# EAGLE design CAN_node_rpm_f2v (EAGLE 8.0.1)
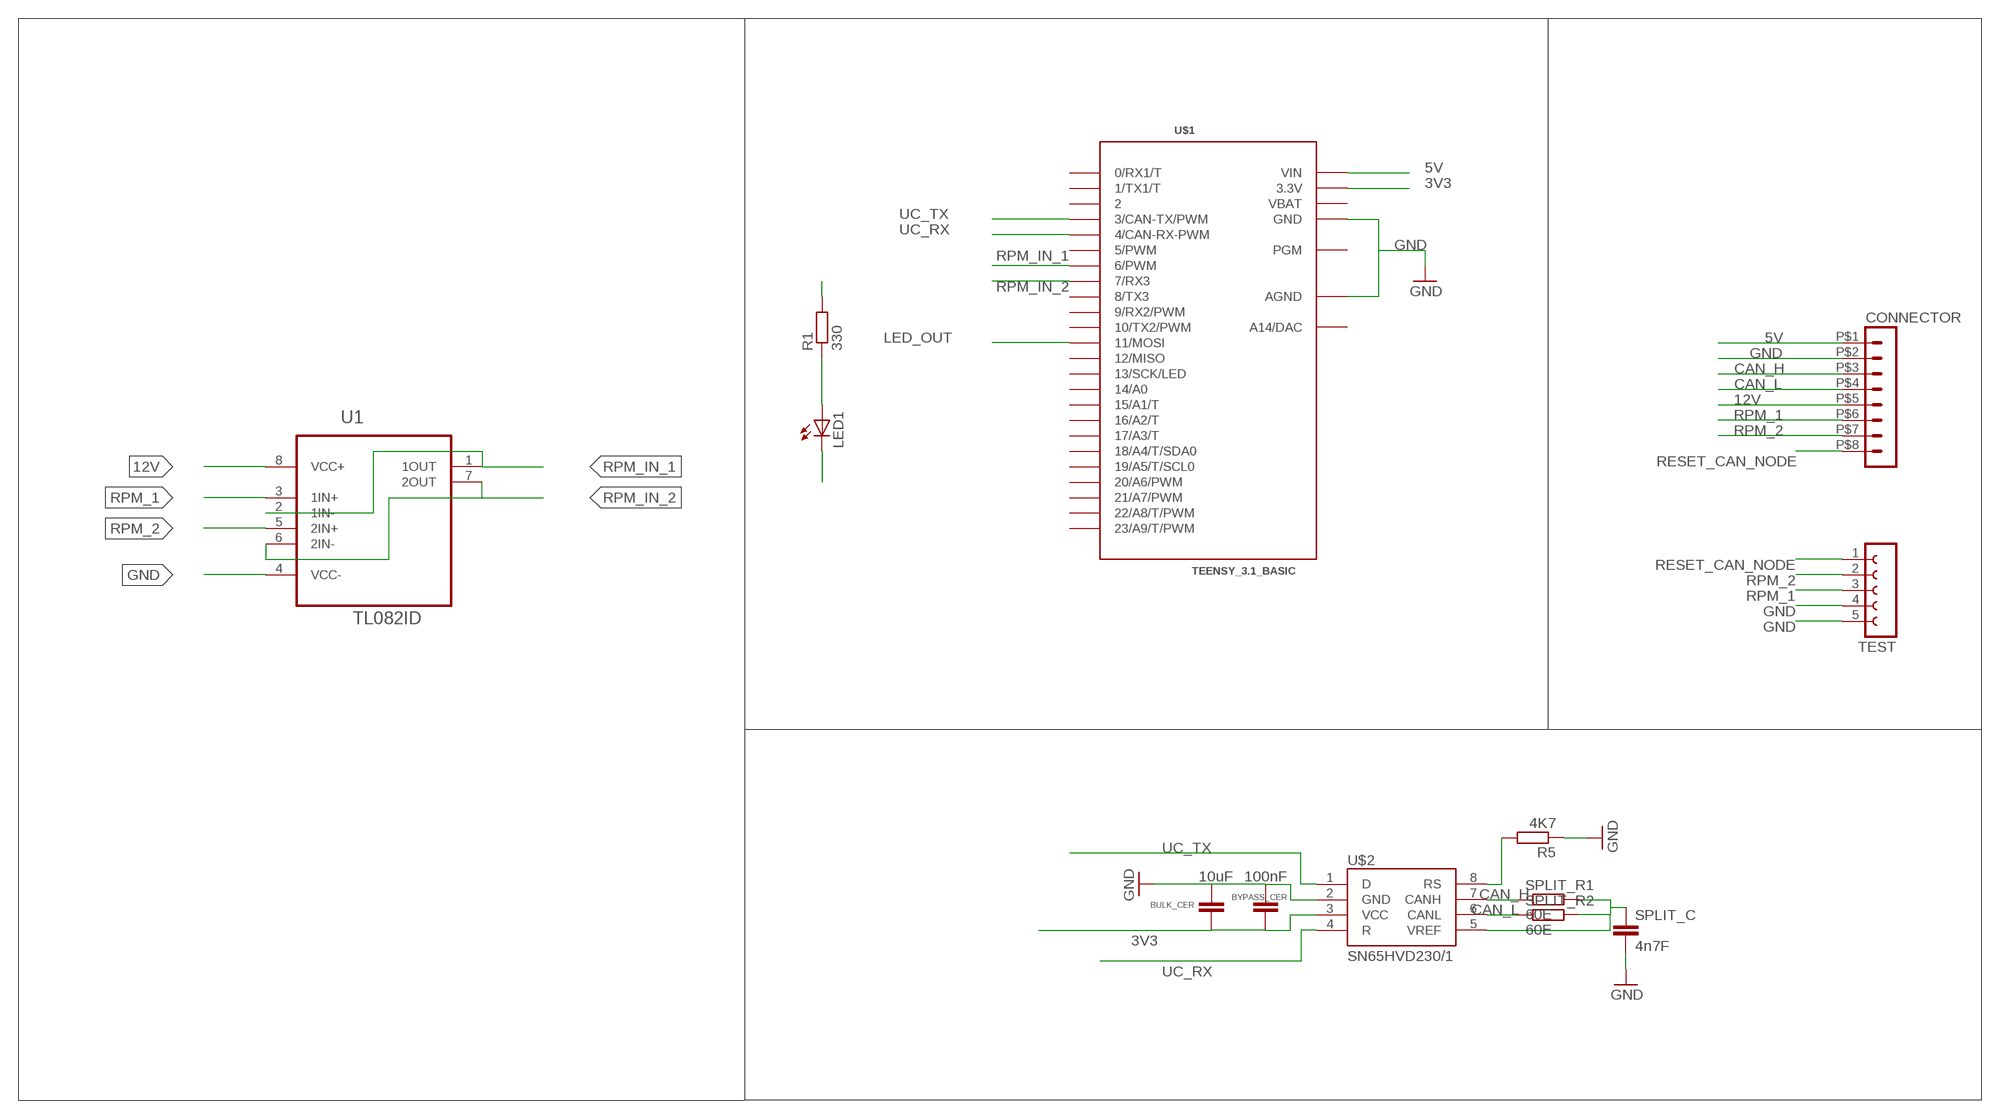
[diagram p0: schematic, sheet 1]

## Parts
BULK_CER  10uF  C-EUC0805  [C0805]
BYPASS_CER  100nF  C-EUC0805  [C0805]
CONNECTOR  HEADER_POS8_43045-0812  [43045-0812]
LED1  LED_LEDSMT1206  [LED_1206]
R1  330  R-EU_R0805  [R0805]
R5  4K7  R-EU_R0805  [R0805]
SPLIT_C  4n7F  C-EUC0805  [C0805]
SPLIT_R1  60E  R-EU_R0805  [R0805]
SPLIT_R2  60E  R-EU_R0805  [R0805]
TEST  FE05-1  [FE05-1]
U1  TL082ID  [SOIC127P600X175-8N]
U$1  TEENSY_3.1_BASIC  [TEENSY_3.1_BASIC]
U$2  SN65HVD230/1  [SO8]

## Nets
3V3: BULK_CER.1 BYPASS_CER.1 U$1.3.3V U$1.3.3V1(3.3V) U$2.3(VCC)
5V: CONNECTOR.P$1 U$1.VIN
12V: CONNECTOR.P$5 U1.8(VCC+)
CAN_H: CONNECTOR.P$3 SPLIT_R1.1 U$2.7(CANH)
CAN_L: CONNECTOR.P$4 SPLIT_R2.1 U$2.6(CANL)
GND: BULK_CER.2 BYPASS_CER.2 CONNECTOR.P$2 LED1.C R5.1 SPLIT_C.2 TEST.4 TEST.5 U1.4(VCC-) U$1.AGND U$1.GND U$1.GND1(GND) U$2.2(GND)
LED_OUT: R1.2 U$1.11(11/MOSI)
N$1: LED1.A R1.1
N$5: R5.2 U$2.8(RS)
N$9: SPLIT_C.1 SPLIT_R1.2 SPLIT_R2.2 U$2.5(VREF)
RESET_CAN_NODE: CONNECTOR.P$8 TEST.1
RPM_1: CONNECTOR.P$6 TEST.3 U1.3(1IN+)
RPM_2: CONNECTOR.P$7 TEST.2 U1.5(2IN+)
RPM_IN_1: U1.1(1OUT) U1.2(1IN-) U$1.6(6/PWM)
RPM_IN_2: U1.6(2IN-) U1.7(2OUT) U$1.7(7/RX3)
UC_RX: U$1.4(4/CAN-RX-PWM) U$2.4(R)
UC_TX: U$1.3(3/CAN-TX/PWM) U$2.1(D)
Unconnected: U$1.0(0/RX1/T) U$1.1(1/TX1/T) U$1.2 U$1.5(5/PWM) U$1.8(8/TX3) U$1.9(9/RX2/PWM) U$1.10(10/TX2/PWM) U$1.12(12/MISO) U$1.13(13/SCK/LED) U$1.14/A0 U$1.15/A1(15/A1/T) U$1.16/A2(16/A2/T) U$1.17/A3(17/A3/T) U$1.18/A4(18/A4/T/SDA0) U$1.19/A5(19/A5/T/SCL0) U$1.20/A6(20/A6/PWM) U$1.21/A7(21/A7/PWM) U$1.22/A8(22/A8/T/PWM) U$1.23/A9(23/A9/T/PWM) U$1.A14(A14/DAC) U$1.PGM

## Power pins joined to a net without a drawn wire
VBAT: U$1.VBAT

## Library data of the parts
BULK_CER BYPASS_CER SPLIT_C = LV:C-EU: CAPACITOR, European symbol
CONNECTOR = IIT_BOMBAY_Racing:HEADER_POS8_?: Molex - Micro-Fit 3.0 Series connector, 3.00mm (0.118") pitch header, 8 positions.
LED1 = IITBRacing_CAN_node_Evo5:LED_LED: LED OSRAM: - CHIPLED LG R971, LG N971, LY N971, LG Q971, LY Q971, LO R971, LY R971 LH N974, LH R974 LS Q976, LO Q976, LY Q976 LO Q996 - Hyper CHIPLED LW Q18S LB Q993, LB Q99A, LB R99A - SideLED LS A670, LO A670, LY A670, LG A670, LP A670 LB A673, LV A673, LT A673, LW A673 LH A674 LY A675 LS A676, LA A676, LO A676, LY A676, LW A676 LS A679, LY A679, LG A679 - Hyper Micro SIDELED® LS Y876, LA Y876, LO Y876, LY Y876 LT Y87S - SmartLED LW L88C, LW L88S LB L89C, LB L89S, LG L890 LS L89K, LO L89K, LY L89K LS L896, LA L896, LO L896, LY L896 - TOPLED LS T670, LO T670, LY T670, LG T670, LP T670 LSG T670, LSP T670, LSY T670, LOP T670, LYG T670 LG T671, LOG T671, LSG T671 LB T673, LV T673, LT T673, LW T673 LH T674 LS T676, LA T676, LO T676, LY T676, LB T676, LH T676, LSB T676, LW T676 LB T67C, LV T67C, LT T67C, LS T67K, LO T67K, LY T67K, LW E67C LS E67B, LA E67B, LO E67B, LY E67B, LB E67C, LV E67C, LT E67C LW T67C LS T679, LY T679, LG T679 LS T770, LO T770, LY T770, LG T770, LP T770 LB T773, LV T773, LT T773, LW T773 LH T774 LS E675, LA E675, LY E675, LS T675 LS T776, LA T776, LO T776, LY T776, LB T776 LHGB T686 LT T68C, LB T68C - Hyper Mini TOPLED® LB M676 - Mini TOPLED Santana® LG M470 LS M47K, LO M47K, LY M47K Source: http://www.osram.convergy.de LUXEON: - LUMILED® LXK2-PW12-R00, LXK2-PW12-S00, LXK2-PW14-U00, LXK2-PW14-V00 LXK2-PM12-R00, LXK2-PM12-S00, LXK2-PM14-U00 LXK2-PE12-Q00, LXK2-PE12-R00, LXK2-PE12-S00, LXK2-PE14-T00, LXK2-PE14-U00 LXK2-PB12-K00, LXK2-PB12-L00, LXK2-PB12-M00, LXK2-PB14-N00, LXK2-PB14-P00, LXK2-PB14-Q00 LXK2-PR12-L00, LXK2-PR12-M00, LXK2-PR14-Q00, LXK2-PR14-R00 LXK2-PD12-Q00, LXK2-PD12-R00, LXK2-PD12-S00 LXK2-PH12-R00, LXK2-PH12-S00 LXK2-PL12-P00, LXK2-PL12-Q00, LXK2-PL12-R00 Source: www.luxeon.com KINGBRIGHT: KA-3528ASYC Source: www.kingbright.com
R1 = resistor:R-EU_: RESISTOR, European symbol
R5 SPLIT_R1 SPLIT_R2 = LV:R-EU_: RESISTOR, European symbol
TEST = con-lsta:FE05-1: FEMALE HEADER; OC_FARNELL: unknown; OC_NEWARK: unknown
U1 = Texas Instruments_By_element14_Batch_1:TL082ID: OPERATIONAL AMPLIFIERS; MPN: TL082ID; OC_FARNELL: 9593403; OC_NEWARK: 08F9350; PACKAGE: SOIC-8; SUPPLIER: TI
U$1 = IIT_BOMBAY_Racing:TEENSY_3.1_BASIC: Footprint for Teensy 3.1 board using all pin connections on the outer perimeter
U$2 = texas_1:SN65HVD230/1

## Net classes
0 default: width 0.127 mm, drill 0.127 mm, clearance 0.127 mm

## Board
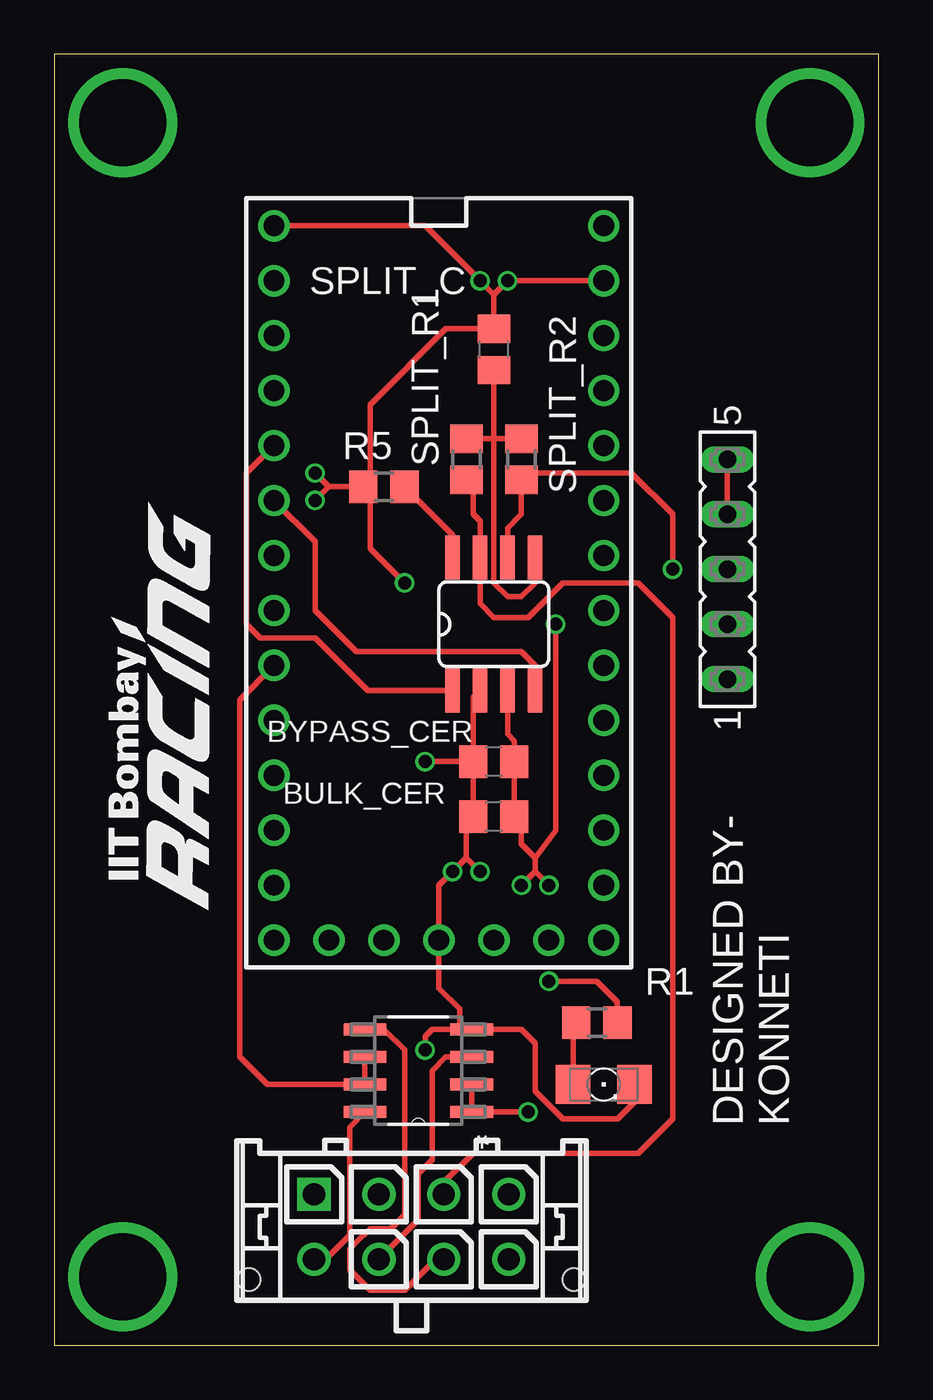
[diagram p1: board, top side]
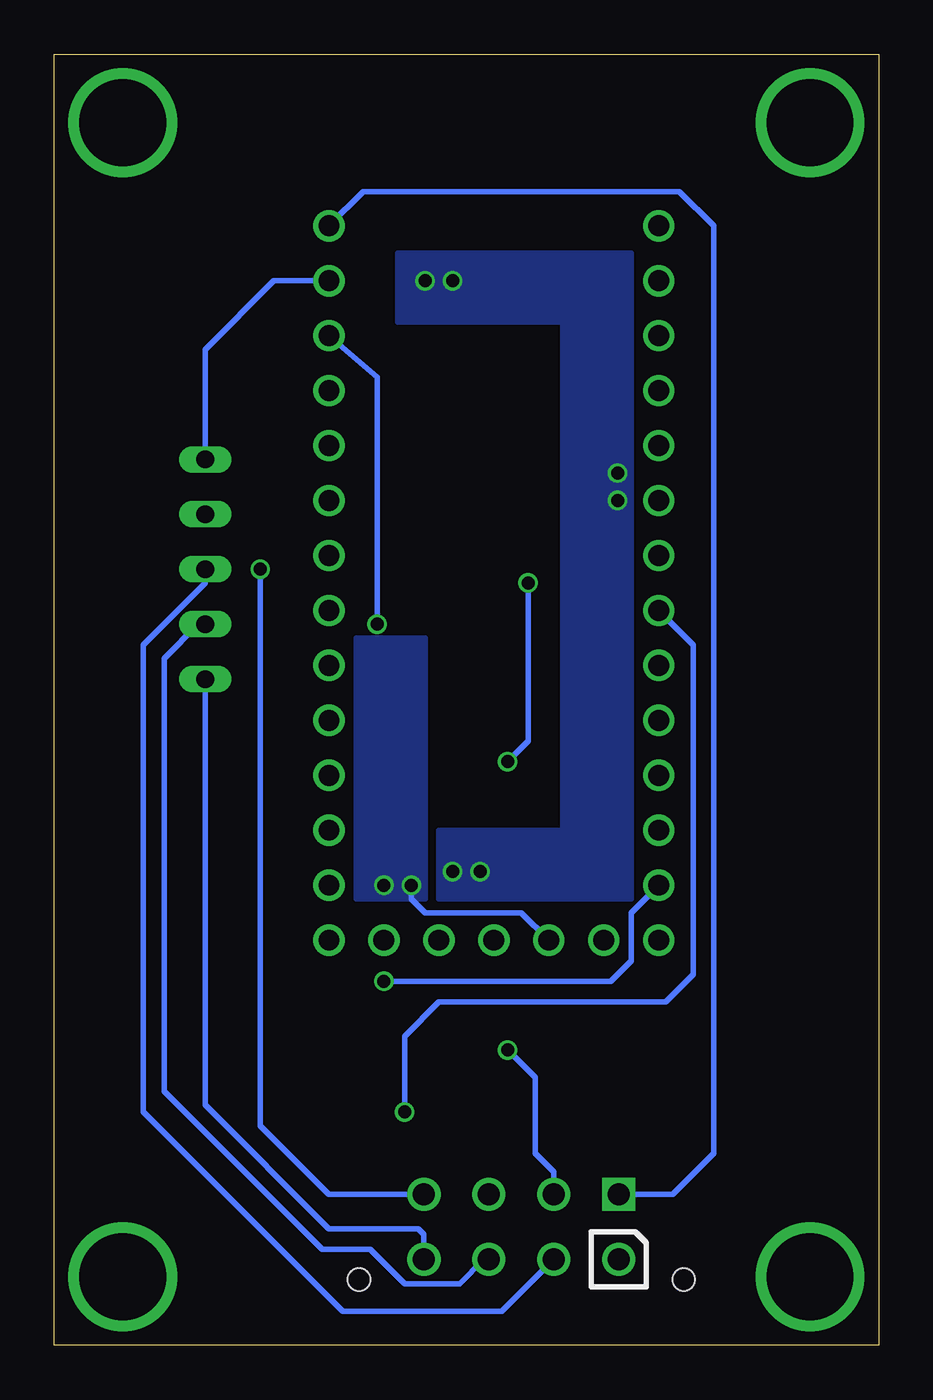
[diagram p2: board, bottom side, seen from below]

Size 38.1 x 59.69 mm. Coordinates in mm from the lower left corner, seen from the top.
Outline: 0,0 38.1,0 38.1,59.69 0,59.69 0,0
Copper layers (1*16): Top 0.035mm / dielectric 1.5mm / Bottom 0.035mm
Design rules "PCB_Power": minimum track width 5mil, minimum drill 10mil, track to track 5mil, track to pad 5mil, pad to pad 5mil, via to via 5mil, smd to smd 5mil, copper to edge 10mil, drill to drill 6mil, minimum pad ring 5mil, minimum via ring 5mil, stop-mask expansion 3mil, vias tented up to drill 0mil, thermal gap 10mil

### Footprints (pad centres in the part's own frame; a part is rotated, then mirrored left to right if it is on the bottom)
C0805 = smd 1.3 x 1.5: 1 -0.95,0; 2 0.95,0
43045-0812 = drill 1.02 square: P$1 4.5,0 | drill 1.02: P$2 1.5,0; P$3 -1.5,0; P$4 -4.5,0; P$5 4.5,3; P$6 1.5,3; P$7 -1.5,3; P$8 -4.5,3 | hole 1.02: 7.5,3.94; -7.5,3.94
LED_1206 = smd 1.6 x 1.803: A -1.422,0; C 1.422,0
R0805 = smd 1.3 x 1.5: 1 -0.95,0; 2 0.95,0
FE05-1 = drill 0.813 long: 1 -5.08,0; 2 -2.54,0; 3 0,0; 4 2.54,0; 5 5.08,0
SOIC127P600X175-8N = smd 1.981 x 0.559: 1 -2.464,1.905; 2 -2.464,0.635; 3 -2.464,-0.635; 4 -2.464,-1.905; 5 2.464,-1.905; 6 2.464,-0.635; 7 2.464,0.635; 8 2.464,1.905
TEENSY_3.1_BASIC = drill 0.965: 0 -7.62,13.97; 1 -7.62,11.43; 2 -7.62,8.89; 3 -7.62,6.35; 3.3V 7.62,11.43; 3.3V1 -2.54,-16.51; 4 -7.62,3.81; 5 -7.62,1.27; 6 -7.62,-1.27; 7 -7.62,-3.81; 8 -7.62,-6.35; 9 -7.62,-8.89; 10 -7.62,-11.43; 11 -7.62,-13.97; 12 -7.62,-16.51; 13 7.62,-16.51; 14/A0 7.62,-13.97; 15/A1 7.62,-11.43; 16/A2 7.62,-8.89; 17/A3 7.62,-6.35; 18/A4 7.62,-3.81; 19/A5 7.62,-1.27; 20/A6 7.62,1.27; 21/A7 7.62,3.81; 22/A8 7.62,6.35; 23/A9 7.62,8.89; A14 5.08,-16.51; AGND 7.62,13.97; GND -7.62,16.51; GND1 0,-16.51; PGM 2.54,-16.51; VBAT -5.08,-16.51; VIN 7.62,16.51
SO8 = smd 0.66 x 2.032: 1 -1.905,-3.073; 2 -0.635,-3.073; 3 0.635,-3.073; 4 1.905,-3.073; 5 1.905,3.073; 6 0.635,3.073; 7 -0.635,3.073; 8 -1.905,3.073

### Placement (x,y rotation side)
BULK_CER  20.32,24.45 180 top
BYPASS_CER  20.32,26.99 180 top
CONNECTOR  16.51,6.99 180 top
LED1  25.4,12.06 0 top
R1  25.08,14.92 0 top
R5  15.24,39.69 0 top
SPLIT_C  20.32,46.04 90 top
SPLIT_R1  19.05,40.96 90 top
SPLIT_R2  21.59,40.96 90 top
TEST  31.11,35.88 90 top
U1  16.83,12.7 180 top
U$1  17.78,35.24 0 top
U$2  20.32,33.34 0 top
U$3  [IITBR_LOGO2]  7.62,19.37 90 top

### Tracks (layer width: path | path; a pad name or v marks a point on that pad's centre or on a via)
3V3  (via drill 0.6)
  Top 0.254: U$2.3 20.95,28.26 21.27,27.94 BYPASS_CER.1 BULK_CER.1 21.59,24.45 21.59,23.18 22.23,22.54 | 22.23,22.54 22.23,21.91 | v21.59,21.27 22.23,21.91 | 22.23,21.91 v22.86,21.27 | v23.18,33.34 23.18,23.81 22.23,22.54
  Bottom 0.254: v23.18,33.34 23.18,44.77 U$1.3.3V | U$1.3.3V1 16.51,20 18.41,20 20.95,20 21.59,20.64 v21.59,21.27
  pour Bottom: 20.95,20.64 20.95,32.7 24.13,32.7 24.13,20.64
5V
  Bottom 0.254: CONNECTOR.P$1 9.53,6.99 7.62,8.89 7.62,51.75 9.21,53.34 23.81,53.34 U$1.VIN
12V
  Top 0.254: CONNECTOR.P$5 12.56,3.98 13.65,5.08 13.65,10.08 U1.8
CAN_H
  Top 0.254: SPLIT_R1.1 19.37,39.69 19.37,38.42 19.68,38.1 U$2.7 19.68,34.29 20.32,33.66 21.91,33.66 23.5,35.24 26.99,35.24 28.57,33.66 28.57,10.48 26.99,8.89 19.37,8.89 18.01,7.53 CONNECTOR.P$3
CAN_L  (via drill 0.6)
  Top 0.254: U$2.6 20.95,37.78 21.59,38.42 SPLIT_R2.1 21.91,40.32 26.67,40.32 28.57,38.42 v28.57,35.88
  Bottom 0.254: v28.57,35.88 28.57,10.79 28.57,10.16 25.4,6.99 24.13,6.99 CONNECTOR.P$4
GND  (via drill 0.6)
  Top 0.254: BYPASS_CER.2 BULK_CER.2 19.05,24.45 19.05,22.54 | 14.61,39.69 R5.1 12.7,39.69 | v12.06,39.05 12.7,39.69 | 12.7,39.69 v12.06,40.32 | 19.05,22.54 v18.41,21.91 17.78,21.27 | 19.05,22.54 v19.68,21.91 | SPLIT_C.2 20.32,48.58 | 20.32,48.58 v19.68,49.21 17.14,51.75 U$1.GND | 20.32,48.58 v20.95,49.21 U$1.AGND | 20.32,46.67 SPLIT_C.2 | BYPASS_CER.2 19.37,29.95 U$2.2 | 14.61,39.69 14.61,43.5 18.1,46.99 SPLIT_C.2 | 14.61,39.69 14.61,36.83 v16.19,35.24 | v17.14,26.99 BYPASS_CER.2 | TEST.5 TEST.4 | LED1.C 26.82,11.26 26.04,10.48 23.5,10.48 22.23,11.75 22.23,13.97 21.59,14.61 U1.4 18.73,14.61 | 18.73,14.61 17.46,14.61 17.14,14.29 v17.14,13.65 | 18.73,14.61 18.73,15.56 17.78,16.51 U$1.GND1 | 17.78,21.27 U$1.GND1 | 17.78,21.27 U$1.GND1
  Bottom 0.254: v16.19,35.24 16.19,27.94 v17.14,26.99 | CONNECTOR.P$2 15.01,8.03 15.88,8.89 15.88,12.38 v17.14,13.65 | U$1.AGND 27.94,49.21 31.11,46.04 TEST.5
  pour Bottom: 11.43,50.48 22.23,50.48 22.23,47.31 14.61,47.31 14.61,23.81 20.32,23.81 20.32,20.64 11.43,20.64
LED_OUT  (via drill 0.6)
  Top 0.254: R1.2 26.03,15.88 25.08,16.83 v22.86,16.83
  Bottom 0.254: v22.86,16.83 12.38,16.83 11.43,17.78 11.43,20 U$1.11
N$1
  Top 0.254: LED1.A 23.98,14.77 R1.1
N$2  (via drill 4.01)
  other vias: 3.17,3.17
N$3  (via drill 4.01)
  other vias: 34.92,3.17
N$4  (via drill 4.01)
  other vias: 3.17,56.52
N$5
  Top 0.254: U$2.8 18.41,37.46 R5.2
N$6  (via drill 4.01)
  other vias: 34.92,56.52
N$9
  Top 0.254: U$2.5 22.23,35.24 21.59,34.61 20.95,34.61 20.32,35.24 20.32,41.91 | SPLIT_R1.2 20.32,41.91 | 20.32,41.91 SPLIT_R2.2 | SPLIT_C.1 20.32,41.91
RESET_CAN_NODE
  Bottom 0.254: 20.95,3.93 CONNECTOR.P$8 21.01,5.13 21.27,5.4 25.4,5.4 31.11,11.11 TEST.1
RPM_1
  Top 0.254: U1.3 18.1,13.34 17.46,12.7 17.46,10.16 17.46,8.57 17.14,8.26 16.83,7.94 16.83,5.8 CONNECTOR.P$6
  Bottom 0.254: TEST.3 31.11,35.24 33.97,32.38 33.97,10.79 24.77,1.59 18.41,1.59 17.41,1.59 CONNECTOR.P$6
RPM_2
  Top 0.254: U1.5 15.24,14.61 16.19,13.65 16.19,8.26 16.19,6.99 16.19,6.03 15.56,5.4 14.61,5.4 13.97,4.76 13.65,4.45 13.65,3.49 14.61,2.54 16.19,2.54 17.64,3.98 CONNECTOR.P$7
  Bottom 0.254: TEST.2 31.43,33.34 33.02,31.75 33.02,11.75 25.72,4.45 23.5,4.45 21.91,2.86 19.37,2.86 18.24,3.98 CONNECTOR.P$7
RPM_IN_1  (via drill 0.6)
  Top 0.254: U1.2 U1.1 v21.91,10.79
  Bottom 0.254: v21.91,10.79 21.91,14.29 20.32,15.88 9.84,15.88 8.57,17.14 8.57,32.38 U$1.6
RPM_IN_2
  Top 0.254: U1.6 U1.7 9.84,12.06 8.57,13.34 8.57,29.84 U$1.7
UC_RX
  Top 0.254: U$2.4 22.23,31.43 21.59,32.07 13.97,32.07 12.06,33.97 12.06,37.15 U$1.4
UC_TX
  Top 0.254: U$2.1 14.5,30.26 12.06,32.7 9.53,32.7 8.89,33.34 8.89,40.32 U$1.3

### Text on the board
tNames: DESIGNED BY- / KONNETI